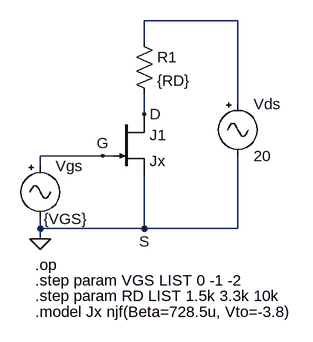
[diagram p0: schematic CircuitoCuartaParte.asc]
CircuitoCuartaParte.asc, the LTspice schematic file:
Version 4
SHEET 1 880 680
WIRE 384 -32 240 -32
WIRE 240 0 240 -32
WIRE 384 96 384 -32
WIRE 240 112 240 80
WIRE 176 176 80 176
WIRE 192 176 176 176
WIRE 80 192 80 176
WIRE 80 288 80 272
WIRE 240 288 240 208
WIRE 240 288 80 288
WIRE 384 288 384 176
WIRE 384 288 240 288
WIRE 80 304 80 288
FLAG 80 304 0
FLAG 176 176 G
FLAG 240 288 S
FLAG 240 112 D
SYMBOL njf 192 112 R0
SYMATTR InstName J1
SYMATTR Value Jx
SYMBOL Misc\\signal 80 176 R0
WINDOW 3 5 97 Left 2
WINDOW 123 0 0 Left 0
WINDOW 39 0 0 Left 0
SYMATTR Value {VGS}
SYMATTR InstName Vgs
SYMBOL Misc\\signal 384 80 R0
WINDOW 123 0 0 Left 0
WINDOW 39 0 0 Left 0
SYMATTR InstName Vds
SYMATTR Value 20
SYMBOL res 224 -16 R0
SYMATTR InstName R1
SYMATTR Value {RD}
TEXT 72 344 Left 2 !.op
TEXT 72 368 Left 2 !.step param VGS LIST 0 -1 -2
TEXT 72 392 Left 2 !.step param RD LIST 1.5k 3.3k 10k
TEXT 72 416 Left 2 !.model Jx njf(Beta=728.5u, Vto=-3.8)

The netlist it stands for:
* CircuitoCuartaParte.asc
J1 D G 0 Jx
Vgs G 0 {VGS}
Vds N001 0 20
R1 N001 D {RD}
.model NJF NJF
.model PJF PJF
.lib standard.jft
.op
.step param VGS LIST 0 -1 -2
.step param RD LIST 1.5k 3.3k 10k
.model Jx njf(Beta=728.5u, Vto=-3.8)
.backanno
.end

* Results of the author's LTspice run, read from the files saved beside the schematic
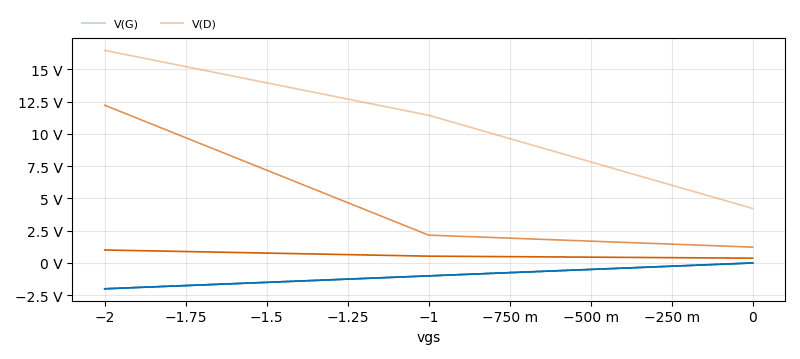
[diagram p1: Operating Point of CircuitoCuartaParte.asc, plotted from the saved traces]
* Operating Point, 3 runs:
*   V(G) [rd=1500]: -2 V at vgs=-2 , 0 V at vgs=0, min -2 V, max 0 V
*   V(G) [rd=3300]: -2 V at vgs=-2 , 0 V at vgs=0, min -2 V, max 0 V
*   V(G) [rd=10000]: -2 V at vgs=-2 , 0 V at vgs=0, min -2 V, max 0 V
*   V(D) [rd=1500]: 16.46 V at vgs=-2 , 4.221 V at vgs=0, min 4.221 V, max 16.46 V
*   V(D) [rd=3300]: 12.21 V at vgs=-2 , 1.225 V at vgs=0, min 1.225 V, max 12.21 V
*   V(D) [rd=10000]: 1.005 V at vgs=-2 , 372.8 mV at vgs=0, min 372.8 mV, max 1.005 V
* From the log:
*   Semiconductor Device Operating Points:
*                           --- JFET Transistors ---
*   Name:      j1
*   Model:     jx
*   Id:      2.36e-03
*   Vgs:    -2.00e+00
*   Vds:     1.65e+01
*   Gm:      2.62e-03
*   Gds:     0.00e+00
*   Cgs:     0.00e+00
*   Cgd:     0.00e+00